# EAGLE schematic robo1rev2 (EAGLE 8.2.1)

## Sheet 1 of 2
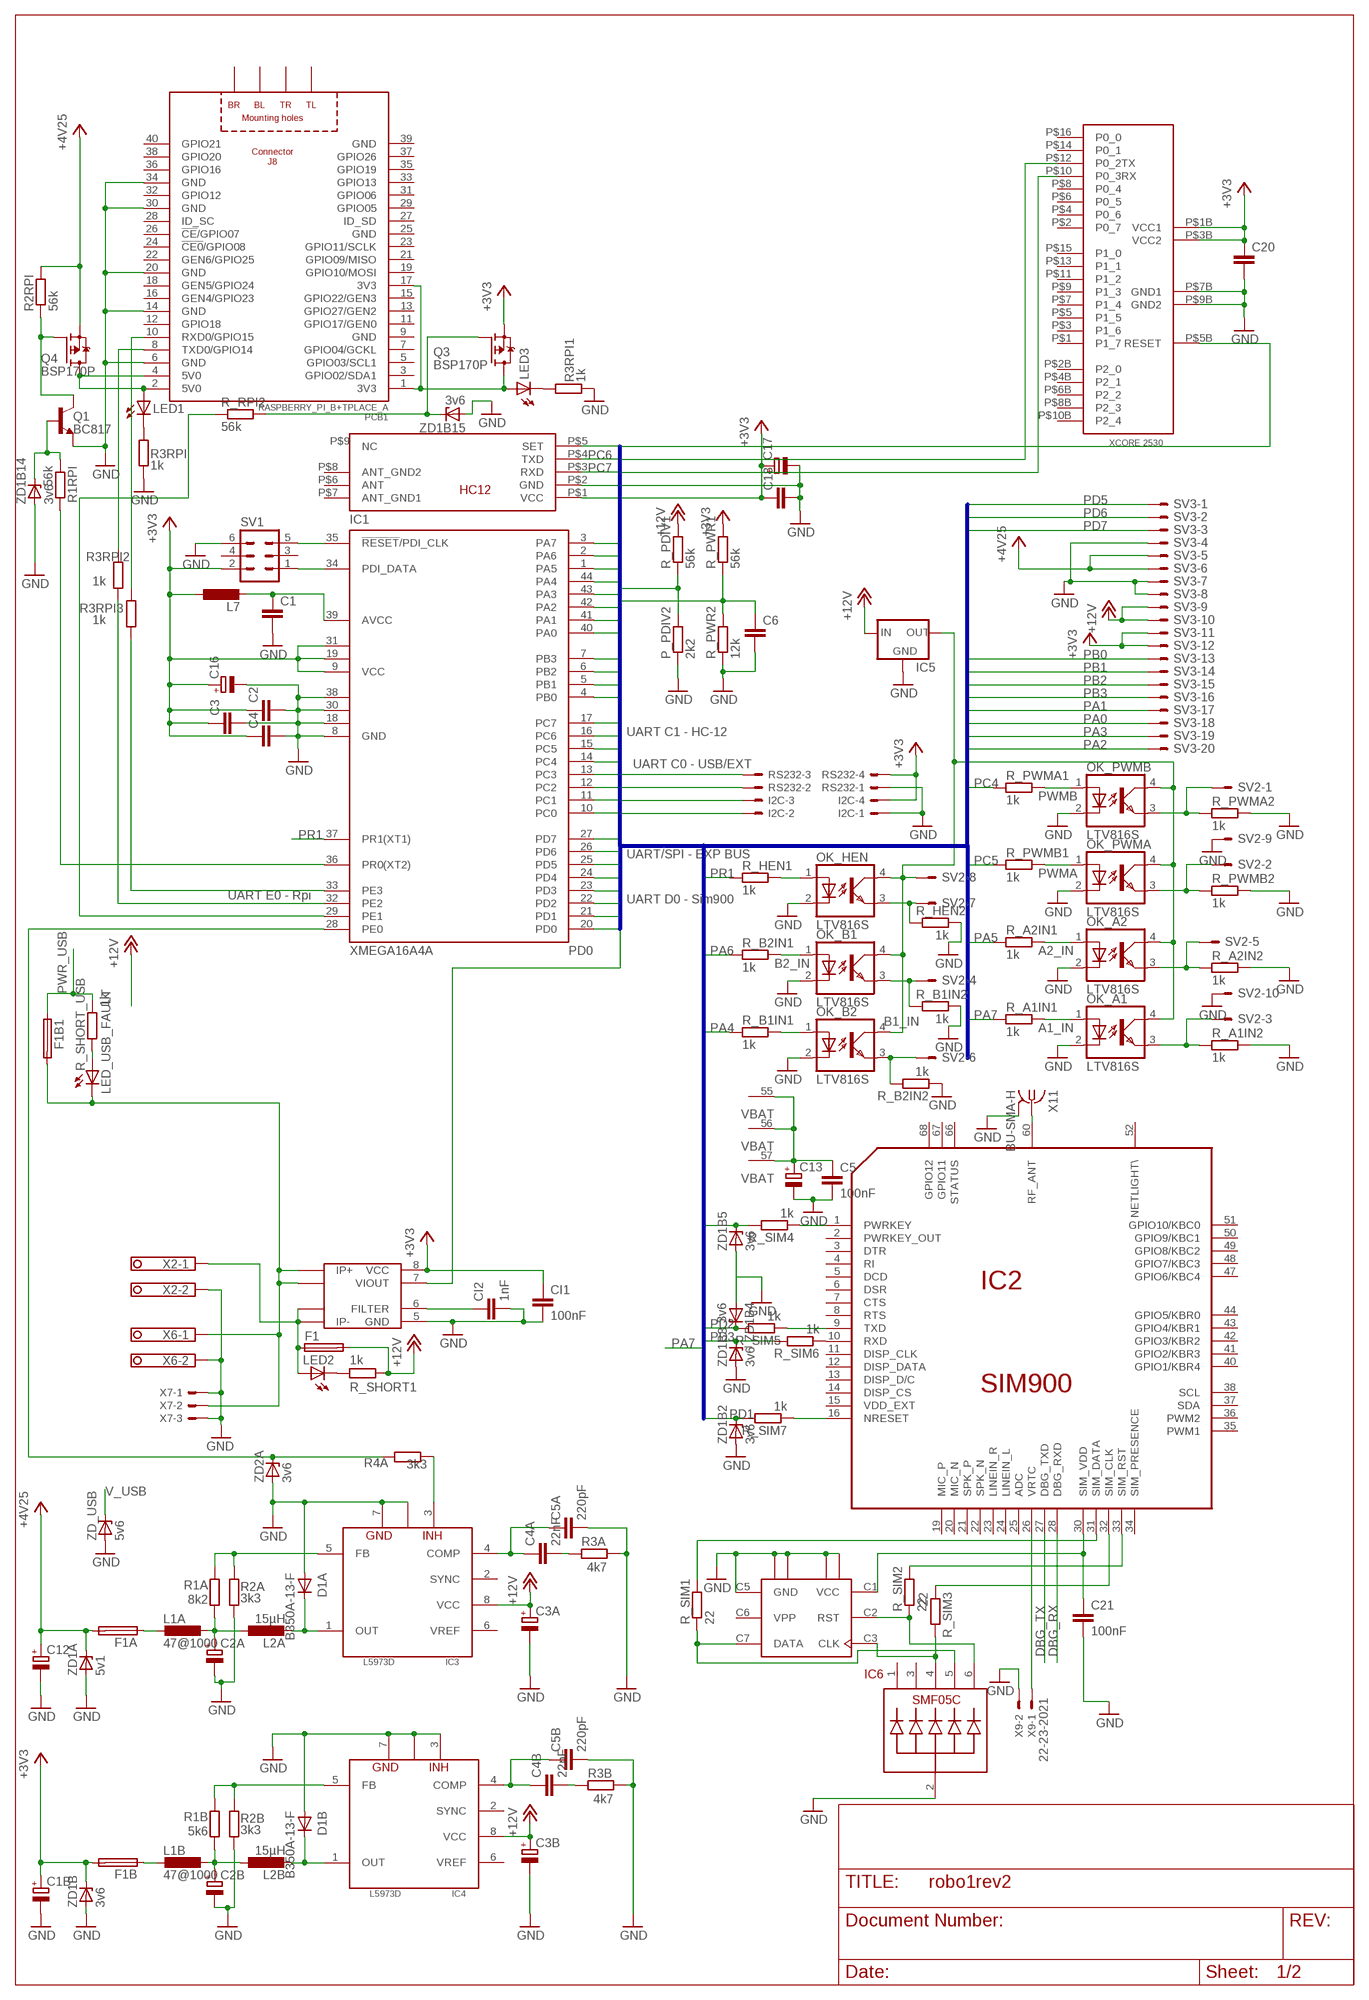
[diagram p0: schematic, sheet 1]

### Parts
C1  C-EUC0805  [C0805]
C1B  CPOL-EU153CLV-0405  [153CLV-0405]
C2  C-EUC0805  [C0805]
C2A  CPOL-EU153CLV-0405  [153CLV-0405]
C2B  CPOL-EU153CLV-0405  [153CLV-0405]
C3  C-EUC0805  [C0805]
C3A  CPOL-EU153CLV-0405  [153CLV-0405]
C3B  CPOL-EU153CLV-0405  [153CLV-0405]
C4  C-EUC0805  [C0805]
C4A  22nF  C-EUC0805  [C0805]
C4B  22nF  C-EUC0805  [C0805]
C5  100nF  C-EUC1206  [C1206]
C5A  220pF  C-EUC0805  [C0805]
C5B  220pF  C-EUC0805  [C0805]
C6  C-EUC0805  [C0805]
C12  CPOL-EU140CLH-0810  [140CLH-0810]
C13  CPOL-EU153CLV-0605  [153CLV-0605]
C16  CPOL-EU153CLV-0405  [153CLV-0405]
C17  CPOL-EU140CLH-0810  [140CLH-0810]
C18  C-EUC0805  [C0805]
C20  C-EUC0805  [C0805]
C21  100nF  C-EUC1206  [C1206]
CI1  100nF  C-EUC0805  [C0805]
CI2  1nF  C-EUC0805  [C0805]
D1A  B350A-13-F  GF1  [SMA-DO214AC]
D1B  B350A-13-F  GF1  [SMA-DO214AC]
F1  PICOFUSE1812  [C1812K]
F1A  PICOFUSE1812  [C1812K]
F1B  PICOFUSE1812  [C1812K]
F1B1  PICOFUSE1206  [C1206K]
I2C  22-23-2041  [22-23-2041]
IC1  XMEGA16A4A  [TQFP44]
IC2  SIM900  [SIM900]
IC3  L5973D  [HSOP8-PAD]
IC4  L5973D  [HSOP8-PAD]
IC5  78LXX  [78LXX]
IC6  SMF05C  [SC-70-6]
L1A  47@1000  L-EUL4532C  [L4532M]
L1B  47@1000  L-EUL4532P  [L4532P]
L2A  15µH  L-EUWE-TPC  [POWER-CHOKE_WE-TPC]
L2B  15µH  L-EUWE-TPC  [POWER-CHOKE_WE-TPC]
L7  L-EUL4035M  [L4035M]
LED1  LS_T679-D2E2-1  [PLCC2]
LED2  LS_T679-D2E2-1  [PLCC2]
LED3  LS_T679-D2E2-1  [PLCC2]
LED_USB_FAULT  LS_T679-D2E2-1  [PLCC2]
OK_A1  LTV816S  [SMD4]
OK_A2  LTV816S  [SMD4]
OK_B1  LTV816S  [SMD4]
OK_B2  LTV816S  [SMD4]
OK_HEN  LTV816S  [SMD4]
OK_PWMA  LTV816S  [SMD4]
OK_PWMB  LTV816S  [SMD4]
P_PDIV2  2k2  R-EU_R1206  [R1206]
PCB1  RASPBERRY_PI_B+TPLACE_A  [RASPBERRY_PI_APLUS_TPLACE]
Q1  BC817  BC817-16LT1SMD  [SOT23-BEC]
Q3  BSP170P  [SOT223]
Q4  BSP170P  [SOT223]
R1A  8k2  R-EU_R1206  [R1206]
R1B  5k6  R-EU_R1206  [R1206]
R1RPI  56k  R-EU_R1206  [R1206]
R2A  3k3  R-EU_R1206  [R1206]
R2B  3k3  R-EU_R1206  [R1206]
R2RPI  56k  R-EU_R1206  [R1206]
R3A  4k7  R-EU_R0805  [R0805]
R3B  4k7  R-EU_R1206  [R1206]
R3RPI  1k  R-EU_R1206  [R1206]
R3RPI1  1k  R-EU_R1206  [R1206]
R3RPI2  1k  R-EU_R1206  [R1206]
R3RPI3  1k  R-EU_R1206  [R1206]
R4A  3k3  R-EU_R0805  [R0805]
R_A1IN1  1k  R-EU_R0805  [R0805]
R_A1IN2  1k  R-EU_R0805  [R0805]
R_A2IN1  1k  R-EU_R0805  [R0805]
R_A2IN2  1k  R-EU_R0805  [R0805]
R_B1IN1  1k  R-EU_R0805  [R0805]
R_B1IN2  1k  R-EU_R0805  [R0805]
R_B2IN1  1k  R-EU_R0805  [R0805]
R_B2IN2  1k  R-EU_R0805  [R0805]
R_HEN1  1k  R-EU_R0805  [R0805]
R_HEN2  1k  R-EU_R0805  [R0805]
R_PDIV1  56k  R-EU_R1206  [R1206]
R_PWMA1  1k  R-EU_R0805  [R0805]
R_PWMA2  1k  R-EU_R0805  [R0805]
R_PWMB1  1k  R-EU_R0805  [R0805]
R_PWMB2  1k  R-EU_R0805  [R0805]
R_PWR1  56k  R-EU_R0805  [R0805]
R_PWR2  12k  R-EU_R0805  [R0805]
R_RPI2  56k  R-EU_R1206  [R1206]
R_SHORT1  1k  R-EU_R1206  [R1206]
R_SHORT_USB  1k  R-EU_R1206  [R1206]
R_SIM1  22  R-EU_R1206  [R1206]
R_SIM2  22  R-EU_R1206  [R1206]
R_SIM3  22  R-EU_R1206  [R1206]
R_SIM4  1k  R-EU_R1206  [R1206]
R_SIM5  1k  R-EU_R1206  [R1206]
R_SIM6  1k  R-EU_R1206  [R1206]
R_SIM7  1k  R-EU_R1206  [R1206]
RS232  22-23-2041  [22-23-2041]
SV1  ML6  [ML6]
SV2  ML10E  [ML10]
SV3  ML20E  [ML20]
U$3  HC-12  [HC-12]
U$4  XCORE2530  [XCORE2530]
U$7  SCU-W0822XR-06115R-BCA0  [115R-BCA0]
U$8  ACS712SO8  [SO-08M]
X2  1751248  [1751248]
X6  1751248  [1751248]
X7  22-23-2031  [22-23-2031]
X9  22-23-2021  [22-23-2021]
X11  BU-SMA-H  [BU-SMA-H]
ZD1A  5v1  BZV55-C5V1  [SOD80C]
ZD1B  3v6  BZV55-C5V1  [SOD80C]
ZD1B2  3v6  BZV55-C5V1  [SOD80C]
ZD1B3  3v6  BZV55-C5V1  [SOD80C]
ZD1B4  3v6  BZV55-C5V1  [SOD80C]
ZD1B5  3v6  BZV55-C5V1  [SOD80C]
ZD1B14  3v6  BZV55-C5V1  [SOD80C]
ZD1B15  3v6  BZV55-C5V1  [SOD80C]
ZD2A  3v6  BZV55-C5V1  [SOD80C]
ZD_USB  5v6  BZV55-C5V1  [SOD80C]

### Nets
+3V3: C1B.+ C2.1 C3.1 C4.1 C16.+ C17.+ C18.1 C20.1 CI1.1 F1B.2 I2C.4 IC1.9(VCC) IC1.19(VCC1) IC1.31(VCC2) L7.1 Q3.3(S) R_PWR1.2 RS232.4 SV1.2 SV3.11 SV3.12 U$3.P$1(VCC) U$4.P$1B(VCC1) U$4.P$3B(VCC2) U$8.8(VCC) ZD1B.C ; also sheet 2
+4V4_BF: C2A.+ L1A.1 L2A.1 R1A.2
+4V35: C5.1 C12.+ C13.+ F1A.2 IC2.55(VBAT) IC2.56(VBAT) IC2.57(VBAT) Q4.3(S) R2RPI.2 SV3.5 SV3.6 ZD1A.C ; supply symbol labelled +4V25 ; also sheet 2
+12V: C3A.+ C3B.+ F1.2 IC3.8(VCC) IC4.8(VCC) IC5.IN R_PDIV1.2 R_SHORT1.2 SV3.9 SV3.10
A1_IN: OK_A1.1(A) R_A1IN1.1
A2_IN: OK_A2.1(A) R_A2IN1.1
AVCC: C1.1 IC1.39(AVCC) L7.2
B1_IN: OK_B2.1(A) R_B1IN1.2
B2_IN: OK_B1.1(A) R_B2IN1.2
COMP1: C4A.1 C5A.1 IC3.4(COMP)
COMP2: C4B.1 C5B.1 IC4.4(COMP)
CPU_RST: IC1.35(!RESET!/PDI_CLK) SV1.5
DBG_RX: IC2.28(DBG_RXD) ; also sheet 2
DBG_TX: IC2.27(DBG_TXD) ; also sheet 2
EXT_RX: IC1.12(PC2) RS232.2 ; also sheet 2
EXT_TX: IC1.13(PC3) RS232.3 ; also sheet 2
GND: C1.2 C1B.- C2.2 C2A.- C2B.- C3.2 C3A.- C3B.- C4.2 C5.2 C5A.2 C5B.2 C6.2 C12.- C13.- C16.- C17.- C18.2 C20.2 C21.2 CI1.2 CI2.2 D1A.A D1B.A I2C.1 IC1.8(GND) IC1.18(GND1) IC1.30(GND2) IC1.38(GND3) IC3.7(GND) IC3.P(GND) IC4.3(INH) IC4.7(GND) IC4.P(GND) IC5.GND IC6.2 OK_A1.2(C) OK_A2.2(C) OK_B1.2(C) OK_B2.2(C) OK_HEN.2(C) OK_PWMA.2(C) OK_PWMB.2(C) P_PDIV2.1 PCB1.6(GND) PCB1.14(GND) PCB1.20(GND) PCB1.30(GND) PCB1.34(GND) Q1.E R2A.1 R2B.1 R3A.1 R3B.1 R3RPI1.1 R3RPI.1 R_A1IN2.1 R_A2IN2.1 R_B1IN2.2 R_B2IN2.1 R_HEN2.2 R_PWMA2.2 R_PWMB2.1 R_PWR2.1 RS232.1 SV1.6 SV2.9 SV2.10 SV3.4 SV3.7 SV3.8 U$3.P$2(GND) U$4.P$7B(GND1) U$4.P$9B(GND2) U$7.C5(GND) U$7.P$1(GND4) U$7.P$2(GND3) U$7.P$3(GND2) U$7.P$4(GND1) U$8.5(GND) X2.2 X6.2 X7.1 X7.3 X9.2 X11.2 X11.3 X11.4 X11.5 ZD1A.A ZD1B2.A ZD1B3.A ZD1B4.A ZD1B5.A ZD1B14.A ZD1B15.A ZD1B.A ZD2A.A ZD_USB.A ; also sheet 2
N$2: IC1.34(PDI_DATA) SV1.1
N$3: PCB1.8(TXD0/GPIO14) R3RPI2.2
N$5: IC3.3(INH) R4A.1
N$6: F1B.1 L1B.2
N$7: F1A.1 L1A.2
N$10: LED2.C R_SHORT1.1
N$11: CI2.1 U$8.6(FILTER)
N$15: Q1.B R1RPI.1 ZD1B14.C
N$18: Q1.C Q4.1(G) R2RPI.1
N$19: LED1.C R3RPI.2
N$20: D1B.K(C) IC4.1(OUT) L2B.2
N$22: C2B.+ L1B.1 L2B.1 R1B.2
N$23: IC3.5(FB) R1A.1 R2A.2
N$25: LED3.C R3RPI1.2
N$26: C4B.2 R3B.2
N$27: IC2.9(TXD) R_SIM5.1
N$29: D1A.K(C) IC3.1(OUT) L2A.2
N$30: C4A.2 R3A.2
N$31: IC4.5(FB) R1B.1 R2B.2
N$32: IC2.26(VRTC) X9.1
N$34: IC2.10(RXD) R_SIM6.1
N$37: LED_USB_FAULT.A R_SHORT_USB.1
N$40: IC2.16(NRESET) R_SIM7.1
N$41: PCB1.10(RXD0/GPIO15) R3RPI3.2
N$42: IC2.60(RF_ANT) X11.1
N$45: OK_HEN.1(A) R_HEN1.1
N$48: OK_HEN.3(EMIT) R_HEN2.1 SV2.7
OPT_A1: OK_A2.3(EMIT) R_A2IN2.2 SV2.5
OPT_A2: OK_A1.3(EMIT) R_A1IN2.2 SV2.3
OPT_A_PWM: OK_PWMB.3(EMIT) R_PWMA2.1 SV2.1
OPT_B1: OK_B2.3(EMIT) R_B2IN2.2 SV2.6
OPT_B2: OK_B1.3(EMIT) R_B1IN2.1 SV2.4
OPT_B_PWM: OK_PWMA.3(EMIT) R_PWMB2.2 SV2.2
PA0: IC1.40(PA0) SV3.18
PA1: IC1.41(PA1) SV3.17
PA2: IC1.42(PA2) SV3.20
PA3: IC1.43(PA3) SV3.19
PA4: IC1.44(PA4) R_B1IN1.1
PA5: IC1.1(PA5) R_A2IN1.2
PA6: IC1.2(PA6) R_B2IN1.1
PA7: IC1.3(PA7) R_A1IN1.2
PB0: IC1.4(PB0) P_PDIV2.2 R_PDIV1.1 SV3.13
PB1: IC1.5(PB1) SV3.14 U$8.7(VIOUT)
PB2: C6.1 IC1.6(PB2) R_PWR1.1 R_PWR2.2 SV3.15
PB3: IC1.7(PB3) SV3.16
PC0: I2C.2 IC1.10(PC0)
PC1: I2C.3 IC1.11(PC1)
PC4: IC1.14(PC4) R_PWMA1.1
PC5: IC1.15(PC5) R_PWMB1.2
PC6: IC1.16(PC6) U$3.P$4(TXD) U$4.P$12(P0_2TX)
PC7: IC1.17(PC7) U$3.P$3(RXD) U$4.P$10(P0_3RX)
PD0: IC1.20(PD0) U$3.P$5(SET) U$4.P$5B(RESET)
PD1: IC1.21(PD1) R_SIM7.2 ZD1B2.C
PD2: IC1.22(PD2) R_SIM5.2 ZD1B4.C
PD3: IC1.23(PD3) R_SIM6.2 ZD1B3.C
PD4: IC1.24(PD4) R_SIM4.2 ZD1B5.C
PD5: IC1.25(PD5) SV3.1
PD6: IC1.26(PD6) SV3.2
PD7: IC1.27(PD7) SV3.3
PE0: IC1.28(PE0) R4A.2 ZD2A.C
PE1: IC1.29(PE1) R_RPI2.1
PE2: IC1.32(PE2) R3RPI2.1
PE3: IC1.33(PE3) R3RPI3.1
PR0: IC1.36(PR0(XT2)) R1RPI.2
PR1: IC1.37(PR1(XT1)) R_HEN1.2
PWMA: OK_PWMA.1(A) R_PWMB1.1
PWMB: OK_PWMB.1(A) R_PWMA1.2
PWR: F1B1.2 LED_USB_FAULT.C U$8.1(IP+) U$8.2(IP+2) X6.1 X7.2
PWR_H: F1.1 LED2.A U$8.3(IP-3) U$8.4(IP-) X2.1
PWR_USB: F1B1.1 R_SHORT_USB.2 ; also sheet 2
RPI_3V3: LED3.A PCB1.1(3V3) PCB1.17(3V3) Q3.2(D) Q3.4(D)
RPI_5V: LED1.A PCB1.2(5V0) PCB1.4(5V0) Q4.2(D) Q4.4(D)
RPI_CTRL_3V3: Q3.1(G) R_RPI2.2 ZD1B15.C
SIM900PWRKEY: IC2.1(PWRKEY) R_SIM4.1
SIM_CLK: IC2.32(SIM_CLK) R_SIM3.1
SIM_DTA: IC2.31(SIM_DATA) R_SIM1.2
SIM_DTA_S: IC6.5 R_SIM1.1 U$7.C7(DATA)
SIM_RST: IC2.33(SIM_RST) R_SIM2.2
SIM_VCC: C21.1 IC2.30(SIM_VDD) U$7.C1(VCC)
SIMCLS_S: IC6.4 R_SIM3.2 U$7.C3(CLK)
SIMRSTS: IC6.6 R_SIM2.1 U$7.C2(RST)
V_H_LOG: IC5.OUT OK_A1.4(COL) OK_A2.4(COL) OK_B1.4(COL) OK_B2.4(COL) OK_HEN.4(COL) OK_PWMA.4(COL) OK_PWMB.4(COL) SV2.8
V_USB: ZD_USB.C ; also sheet 2
Unconnected: IC2.2(PWRKEY_OUT) IC2.3(DTR) IC2.4(RI) IC2.5(DCD) IC2.6(DSR) IC2.7(CTS) IC2.8(RTS) IC2.11(DISP_CLK) IC2.12(DISP_DATA) IC2.13(DISP_D/C) IC2.14(DISP_CS) IC2.15(VDD_EXT) IC2.19(MIC_P) IC2.20(MIC_N) IC2.21(SPK_P) IC2.22(SPK_N) IC2.23(LINEIN_R) IC2.24(LINEIN_L) IC2.25(ADC) IC2.34(SIM_PRESENCE) IC2.35(PWM1) IC2.36(PWM2) IC2.37(SDA) IC2.38(SCL) IC2.40(GPIO1/KBR4) IC2.41(GPIO2/KBR3) IC2.42(GPIO3/KBR2) IC2.43(GPIO4/KBR1) IC2.44(GPIO5/KBR0) IC2.47(GPIO6/KBC4) IC2.48(GPIO7/KBC3) IC2.49(GPIO8/KBC2) IC2.50(GPIO9/KBC1) IC2.51(GPIO10/KBC0) IC2.52(NETLIGHT\) IC2.66(STATUS) IC2.67(GPIO11) IC2.68(GPIO12) IC3.2(SYNC) IC3.6(VREF) IC4.2(SYNC) IC4.6(VREF) IC6.1 IC6.3 PCB1.3(GPIO02/SDA1) PCB1.5(GPIO03/SCL1) PCB1.7(GPIO04/GCKL) PCB1.11(GPIO17/GEN0) PCB1.12(GPIO18) PCB1.13(GPIO27/GEN2) PCB1.15(GPIO22/GEN3) PCB1.16(GEN4/GPIO23) PCB1.18(GEN5/GPIO24) PCB1.19(GPIO10/MOSI) PCB1.21(GPIO09/MISO) PCB1.22(GEN6/GPIO25) PCB1.23(GPIO11/SCLK) PCB1.24(!CE0!/GPIO08) PCB1.26(!CE!/GPIO07) PCB1.27(ID_SD) PCB1.28(ID_SC) PCB1.29(GPIO05) PCB1.31(GPIO06) PCB1.32(GPIO12) PCB1.33(GPIO13) PCB1.35(GPIO19) PCB1.36(GPIO16) PCB1.37(GPIO26) PCB1.38(GPIO20) PCB1.40(GPIO21) PCB1.PE_BL(BL) PCB1.PE_BR(BR) PCB1.PE_TL(TL) PCB1.PE_TR(TR) SV1.3 SV1.4 U$3.P$6(ANT) U$3.P$7(ANT_GND1) U$3.P$8(ANT_GND2) U$3.P$9(NC) U$4.P$1(P1_7) U$4.P$2(P0_7) U$4.P$2B(P2_0) U$4.P$3(P1_6) U$4.P$4(P0_6) U$4.P$4B(P2_1) U$4.P$5(P1_5) U$4.P$6(P0_5) U$4.P$6B(P2_2) U$4.P$7(P1_4) U$4.P$8(P0_4) U$4.P$8B(P2_3) U$4.P$9(P1_3) U$4.P$10B(P2_4) U$4.P$11(P1_2) U$4.P$13(P1_1) U$4.P$14(P0_1) U$4.P$15(P1_0) U$4.P$16(P0_0)

### Buses
PA[0..7],PB[0..3],PC[0..7],PD[0..7],PR[0..1]

### Notes on the sheet
- UART C1 - HC-12
- UART C0 - USB/EXT
- UART/SPI - EXP BUS
- UART E0 - Rpi
- UART D0 - Sim900

## Sheet 2 of 2
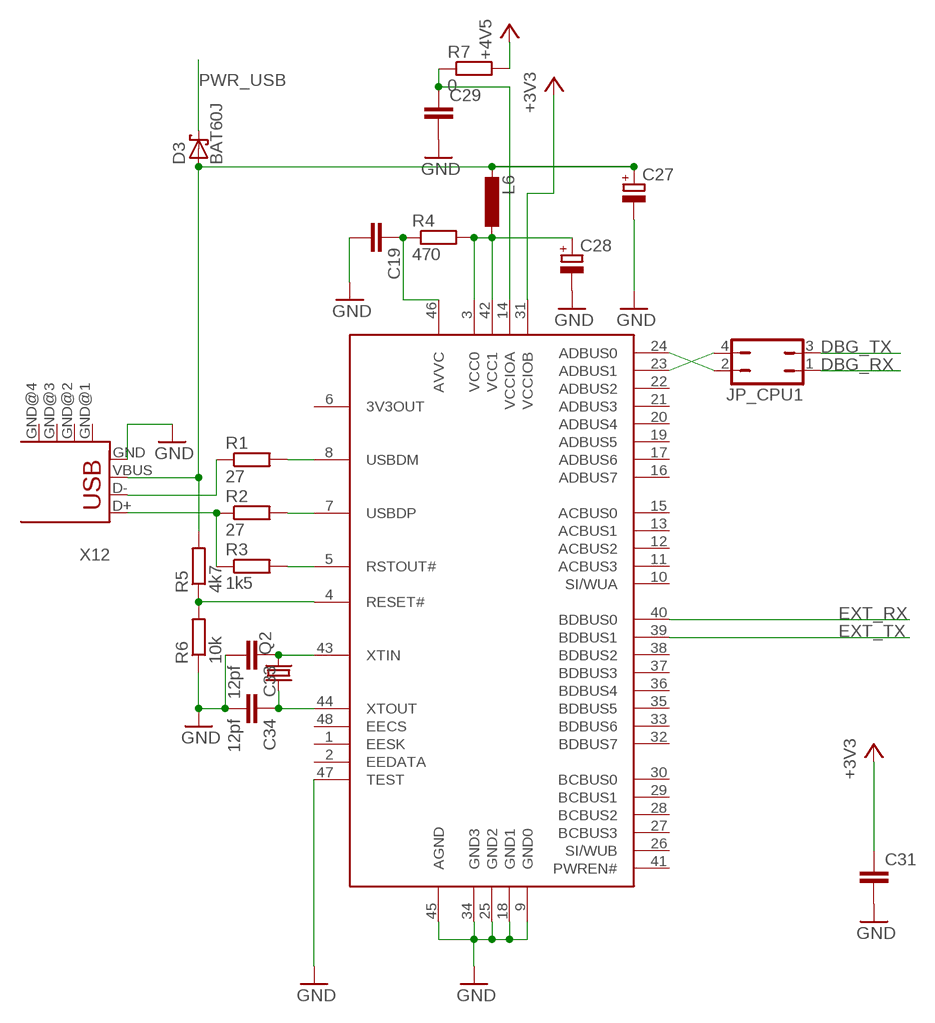
[diagram p1: schematic, sheet 2]

### Parts
C19  C-EUC0805  [C0805]
C27  CPOL-EU153CLV-0405  [153CLV-0405]
C28  CPOL-EU153CLV-0405  [153CLV-0405]
C29  C-EUC1206  [C1206]
C31  C-EUC1206  [C1206]
C33  12pf  C-EUC0805  [C0805]
C34  12pf  C-EUC0805  [C0805]
D3  BAT60J  [SOD323_ST]
IC7  FT2232C  [LQFP]
JP_CPU1  JP2Q  [JP2Q]
L6  L-EUL2012C  [L2012C]
Q2  CRYSTALHC49S  [HC49/S]
R1  27  R-EU_M1206  [M1206]
R2  27  R-EU_M1206  [M1206]
R3  1k5  R-EU_M1206  [M1206]
R4  470  R-EU_M0805  [M0805]
R5  4k7  R-EU_M1206  [M1206]
R6  10k  R-EU_M1206  [M1206]
R7  0  R-EU_M1206  [M1206]
X12  USB-SHIELD  [USB-M-S1]

### Nets
+3V3: C31.1 IC7.31(VCCIOB) ; also sheet 1
+4V35: R7.2 ; supply symbol labelled +4V5 ; also sheet 1
A_RX: IC7.23(ADBUS1) JP_CPU1.4
A_TX: IC7.24(ADBUS0) JP_CPU1.2
DBG_RX: JP_CPU1.1 ; also sheet 1
DBG_TX: JP_CPU1.3 ; also sheet 1
EXT_RX: IC7.40(BDBUS0) ; also sheet 1
EXT_TX: IC7.39(BDBUS1) ; also sheet 1
FT_AVCC: C19.1 IC7.46(AVVC) R4.1
FT_RST: IC7.4(RESET#) R5.1 R6.2
FT_VCC: C28.+ IC7.3(VCC0) IC7.42(VCC1) L6.1 R4.2
FT_XIN: C33.1 IC7.43(XTIN) Q2.2
FT_XOUT: C34.1 IC7.44(XTOUT) Q2.1
GND: C19.2 C27.- C28.- C29.2 C31.2 C33.2 C34.2 IC7.9(GND0) IC7.18(GND1) IC7.25(GND2) IC7.34(GND3) IC7.45(AGND) IC7.47(TEST) R6.1 X12.GND ; also sheet 1
N$13: IC7.8(USBDM) R1.2
N$14: IC7.7(USBDP) R2.2
N$16: R2.1 R3.1 X12.D+
N$17: R1.1 X12.D-
N$21: IC7.5(RSTOUT#) R3.2
N$28: C29.1 IC7.14(VCCIOA) R7.1
PWR_USB: D3.C ; also sheet 1
V_USB: C27.+ D3.A L6.2 R5.2 X12.VBUS ; also sheet 1
Unconnected: IC7.1(EESK) IC7.2(EEDATA) IC7.6(3V3OUT) IC7.10(SI/WUA) IC7.11(ACBUS3) IC7.12(ACBUS2) IC7.13(ACBUS1) IC7.15(ACBUS0) IC7.16(ADBUS7) IC7.17(ADBUS6) IC7.19(ADBUS5) IC7.20(ADBUS4) IC7.21(ADBUS3) IC7.22(ADBUS2) IC7.26(SI/WUB) IC7.27(BCBUS3) IC7.28(BCBUS2) IC7.29(BCBUS1) IC7.30(BCBUS0) IC7.32(BDBUS7) IC7.33(BDBUS6) IC7.35(BDBUS5) IC7.36(BDBUS4) IC7.37(BDBUS3) IC7.38(BDBUS2) IC7.41(PWREN#) IC7.48(EECS) X12.GND@1(GND) X12.GND@2(GND) X12.GND@3(GND) X12.GND@4(GND)

## Power pins joined to a net without a drawn wire
GND: IC2.17(GND) IC2.18(GND) IC2.29(GND) IC2.39(GND) IC2.45(GND) IC2.46(GND) IC2.53(GND) IC2.54(GND) IC2.58(GND) IC2.59(GND) IC2.61(GND) IC2.62(GND) IC2.63(GND) IC2.64(GND) IC2.65(GND) PCB1.9(GND) PCB1.25(GND) PCB1.39(GND)
VPP: U$7.C6(VPP)

## Library data of the parts
C1-C4 C4A C4B C5 C5A C5B C6 C18-C21 C29 C31 C33 C34 CI1 CI2 = rcl:C-EU: CAPACITOR, European symbol
C1B C2A C2B C3A C3B C12 C13 C16 C17 C27 C28 = rcl:CPOL-EU: POLARIZED CAPACITOR, European symbol
D1A D1B = diode:GF1: DIODE
D3 = diode:BAT60J: Schottky barrier diode Source: www.st.com, BAT60J.pdf
F1 F1A F1B F1B1 = polymer:PICOFUSE: PICOFUSE 19275, Wickmann
I2C RS232 = con-molex:22-23-2041: .100" (2.54mm) Center Header - 4 Pin; MF: MOLEX; MPN: 22-23-2041; OC_FARNELL: 1462920; OC_NEWARK: 38C0355
IC1 = atmel:XMEGA16A4: MICROCONTROLLER Features High-performance, Low-power 8/16-bit AVR XMEGA Microcontroller Non-Volatile Program and Data Memories - 16 KB - 128 KB of In-System Self-Programmable Flash - 4 KB - 8 KB Boot Code Section with Independent Lock Bits - 1 KB - 2 KB EEPROM - 2 KB - 8 KB Internal SRAM Peripheral Features - Four-channel DMA Controller with support for external requests - Eight-channel Event System - Five 16-bit Timer/Counters Three Timer/Counters with 4 Output Compare or Input Capture channels Two Timer/Counters with 2 Output Compare or Input Capture channels High-Resolution Extensions on all Timer/Counters Advanced Waveform Extension on one Timer/Counter - Five USARTs IrDA Extension on one USART - Two Two-Wire Interfaces with dual address match (I2C and SMBus compatible) - Two SPIs (Serial Peripheral Interfaces) peripherals - AES and DES Crypto Engine - 16-bit Real Time Counter with Separate Oscillator - One Twelve-channel, 12-bit, 2 Msps Analog to Digital Converter - One Two-channel, 12-bit, 1 Msps Digital to Analog Converter - Two Analog Comparators with Window compare function - External Interrupts on all General Purpose I/O pins - Programmable Watchdog Timer with Separate On-chip Ultra Low Power Oscillator Special Microcontroller Features - Power-on Reset and Programmable Brown-out Detection - Internal and External Clock Options with PLL - Programmable Multi-level Interrupt Controller - Sleep Modes: Idle, Power-down, Standby, Power-save, Extended Standby - Advanced Programming, Test and Debugging Interfaces PDI (Program and Debug Interface) for programming, test and debugging I/O and Packages - 34 Programmable I/O Lines - 44 - lead TQFP - 44 - pad VQFN/QFN - 49 - ball VFBGA Operating Voltage - 1.6 - 3.6V Speed performance - 0 - 12 MHz @ 1.6 - 3.6V - 0 - 32 MHz @ 2.7 - 3.6V Drawn by Dipl.-Ing. (FH) Robert Siegler Created: 27.05.09; OC_FARNELL: unknown; OC_NEWARK: unknown
IC2 = sim900:SIM900
IC3 IC4 = vreg-pulse:L5973: 2A SWITCH STEP DOWN SWITCHING REGULATOR
IC5 = v-reg:78LXX: VOLTAGE REGULATOR
IC6 = smf05c:SMF05C
IC7 = ft2232c:FT2232C
JP_CPU1 = jumper:JP2Q: JUMPER
L1A L1B L2A L2B L6 L7 = rcl:L-EU: INDUCTOR, European symbol
LED1-LED3 LED_USB_FAULT = led:*_T679-?-1: LC TOPLED® Low Current LED Source: http://catalog.osram-os.com .. LG_LS_LY_T679_OBS.pdf; COLOR: super-red
OK_A1 OK_A2 OK_B1 OK_B2 OK_HEN OK_PWMA OK_PWMB = optocoupler:LTV816: OPTO COUPLER Source: LITEON, LTV816.pdf; OC_FARNELL: unknown; OC_NEWARK: unknown
P_PDIV2 R1 R1A R1B R1RPI R2 R2A R2B R2RPI R3 R3A R3B R3RPI R3RPI1-R3RPI3 R4 R4A R5-R7 R_A1IN1 R_A1IN2 R_A2IN1 R_A2IN2 R_B1IN1 R_B1IN2 R_B2IN1 R_B2IN2 R_HEN1 R_HEN2 R_PDIV1 R_PWMA1 R_PWMA2 R_PWMB1 R_PWMB2 R_PWR1 R_PWR2 R_RPI2 R_SHORT1 R_SHORT_USB R_SIM1-R_SIM7 = rcl:R-EU_: RESISTOR, European symbol
PCB1 = raspberry:RASPBERRY_PI_B+: Raspberry Pi B+ Basedon issue: Thursday, July 10, 2014 - Rev 1.2 LBR by Tim Rettmann 07-2014
Q1 = transistor-npn:BC817*: NPN Transistor
Q2 = crystal:CRYSTAL: CRYSTAL; OC_FARNELL: 1667008; OC_NEWARK: unknown
Q3 Q4 = transistor-fet:BSP170P: SIPMOS(R) Small-Signal-Transistor P-Channel, Enhancement mode Source: http://www.infineon.com/upload/Document/BSP170P_Rev2.4.pdf
SV1 = con-ml:ML6: HARTING; OC_FARNELL: unknown; OC_NEWARK: unknown
SV2 = con-ml:ML10E: HARTING; OC_FARNELL: unknown; OC_NEWARK: unknown
SV3 = con-ml:ML20E: HARTING; OC_FARNELL: unknown; OC_NEWARK: unknown
U$3 = sim900:HC-12: HC-12 Wireless Serial Port Communication Module
U$4 = RobotElementy:XCORE2530
U$7 = con-sim:SCU-W0822XR-06
U$8 = current:ACS712
X2 X6 = con-phoenix-350:1751248: MKDS 1/ 2-3,5 Printklemme Nennstrom: 10 A Bemessungsspannung: 160 V Raster: 3,5 mm Polzahl: 2 Montageart: Löten Anschlussart: Schraubanschluss Anschlussrichtung vom Leiter zur Platine: 0° Source: http://eshop.phoenixcontact.com .. 1751248.pdf; OC_FARNELL: unknown; OC_NEWARK: unknown
X7 = con-molex:22-23-2031: .100" (2.54mm) Center Header - 3 Pin; MF: MOLEX; MPN: 22-23-2031; OC_FARNELL: 1462950; OC_NEWARK: 30C0862
X9 = con-molex:22-23-2021: .100" (2.54mm) Center Header - 2 Pin; MF: MOLEX; MPN: 22-23-2021; OC_FARNELL: 1462926; OC_NEWARK: 25C3832
X11 = con-coax:BU-SMA-H: FEMALE SMA CONNECTOR Radiall; OC_FARNELL: unknown; OC_NEWARK: unknown
X12 = usb:USB-SHIELD
ZD1A ZD1B ZD1B2-ZD1B5 ZD1B14 ZD1B15 ZD2A ZD_USB = diodes:BZV55-C5V1